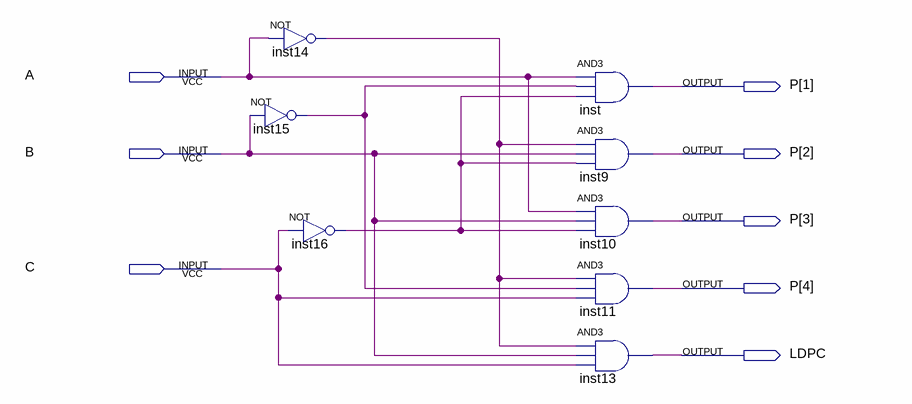
[diagram p0: schematic sheet]
// Quartus schematic decodec.bdf as structural Verilog: 8 symbols, 8 pins
module decodec (
  input  A,
  input  B,
  input  C,
  output [4:1] P,
  output LDPC
);

  wire inst14_out, inst15_out, inst16_out;

  not inst14 (inst14_out, A);
  not inst15 (inst15_out, B);
  not inst16 (inst16_out, C);
  and inst (P[1], A, inst15_out, inst16_out);
  and inst9 (P[2], inst14_out, B, inst16_out);
  and inst10 (P[3], A, B, inst16_out);
  and inst11 (P[4], inst14_out, inst15_out, C);
  and inst13 (LDPC, inst14_out, B, C);
endmodule
